# EAGLE design SoundShield (EAGLE 9.6.2)
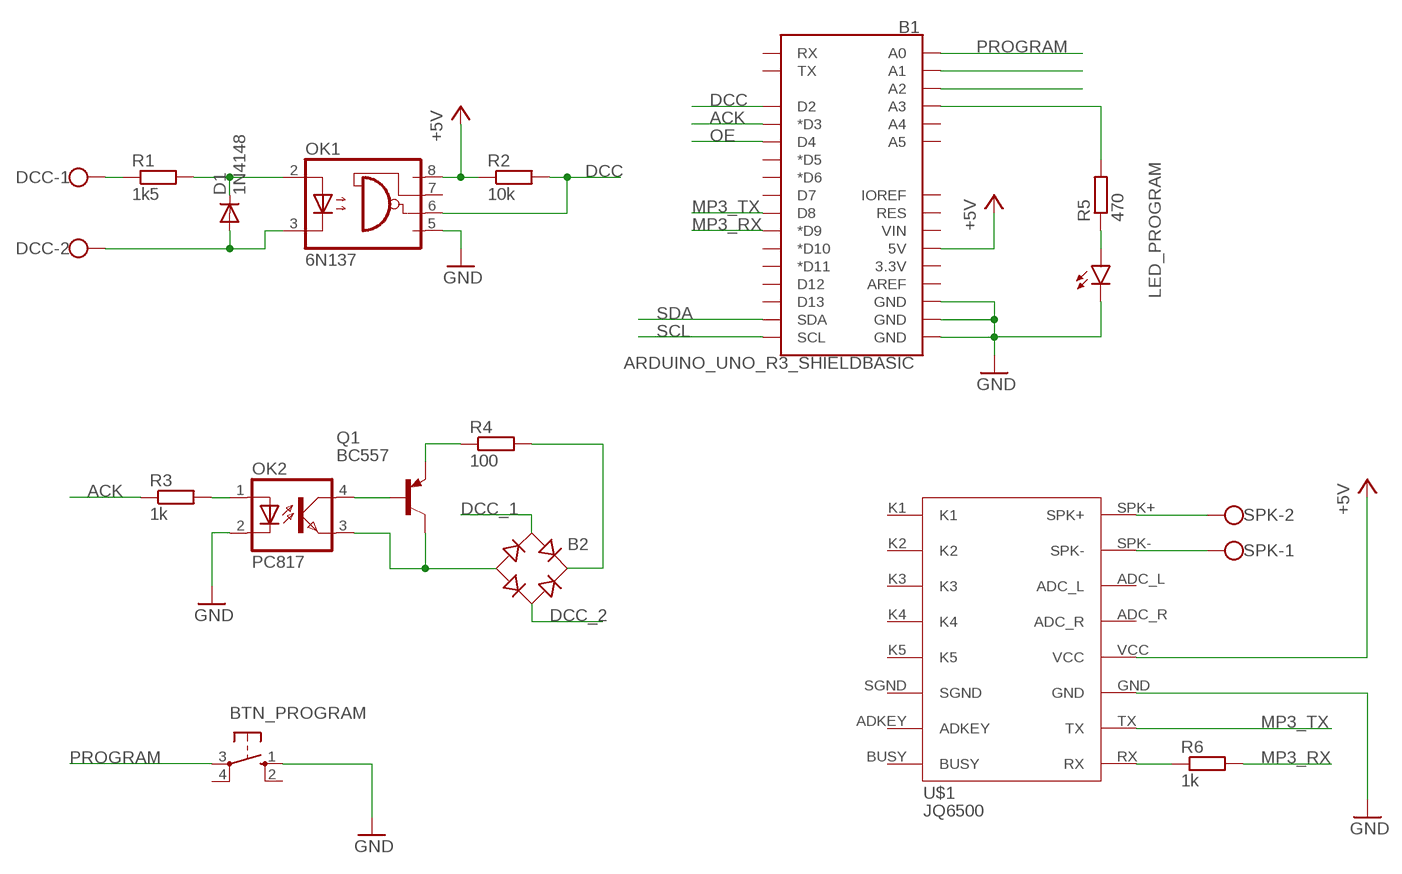
[diagram p0: schematic, sheet 1]

## Parts
B1  ARDUINO_UNO_R3_SHIELDBASIC  [UNO_R3_SHIELD]
B2  RB1A  [RB1A]
BTN_PROGRAM  10-XX  [B3F-10XX]
D1  1N4148  1N4148DO35-7  [DO35-7]
DCC  W237-102  [W237-102]
LED_PROGRAM  LED3MM  [LED3MM]
OK1  6N137  [DIL08]
OK2  PC817  [DIL04]
Q1  BC557  [TO92]
R1  1k5  R-EU_0207/2V  [0207/2V]
R2  10k  R-EU_0207/2V  [0207/2V]
R3  1k  R-EU_0207/2V  [0207/2V]
R4  100  R-EU_0207/2V  [0207/2V]
R5  470  R-EU_0207/2V  [0207/2V]
R6  1k  R-EU_0207/2V  [0207/2V]
SPK  W237-102  [W237-102]
U$1  JQ6500  [JQ6500-PACKAGE]

## Nets
+5V: B1.5V OK1.8(VCC) R2.1 U$1.VCC
ACK: B1.D3(*D3) R3.1
DCC [dcc]: B1.D2 OK1.6(VO) R2.2
DCC_1 [dcc]: B2.AC1 DCC.1 R1.1
DCC_2 [dcc]: B2.AC2 D1.A DCC.2 OK1.3(C)
DOWN: B1.A2
GND: B1.GND@0(GND) B1.GND@1(GND) B1.GND@2(GND) BTN_PROGRAM.1(S) LED_PROGRAM.K(C) OK1.5(GND) OK2.2(C) U$1.GND
MP3_RX: B1.D9(*D9) R6.2
MP3_TX: B1.D8 U$1.TX
N$1: B2.- OK2.3(EMIT) Q1.3(C)
N$2: D1.C OK1.2(A) R1.2
N$3: B1.A3 R5.2
N$4: LED_PROGRAM.A R5.1
N$5: SPK.2 U$1.SPK+
N$6: SPK.1 U$1.SPK-
N$8: OK2.1(A) R3.2
N$9: OK2.4(COL) Q1.2(B)
N$10: Q1.1(E) R4.1
N$11: B2.+ R4.2
N$12: R6.1 U$1.RX
OE: B1.D4
PROGRAM: B1.A0 BTN_PROGRAM.3(P)
SCL: B1.SCL
SDA: B1.SDA
UP: B1.A1
Unconnected: B1.3.3V B1.A4 B1.A5 B1.AREF B1.D5(*D5) B1.D6(*D6) B1.D7 B1.D10(*D10) B1.D11(*D11) B1.D12 B1.D13 B1.IOREF B1.RES B1.RX B1.TX B1.VIN BTN_PROGRAM.2(S1) BTN_PROGRAM.4(P1) OK1.7(VE) U$1.ADC_L U$1.ADC_R U$1.ADKEY U$1.BUSY U$1.K1 U$1.K2 U$1.K3 U$1.K4 U$1.K5 U$1.SGND

## Library data of the parts
B1 = SparkFun-Boards:ARDUINO_UNO_R3_SHIELD: Arduino R3 Shield Footprint Shield form compatible with the Arduino Uno R3. SparkFun Products: MG2639 Cellular Shield <https://www.sparkfun.com/products/13120> MIDI Shield <https://www.sparkfun.com/products/12898> R3 Stackable Headers Kit <https://www.sparkfun.com/products/11417>
B2 = rectifier:RB1A: RECTIFIER 1 A
BTN_PROGRAM = switch-omron:10-XX: OMRON SWITCH; MPN: B3F-1000; OC_FARNELL: 176432; OC_NEWARK: 36M3542
D1 = diode:1N4148: DIODE high speed (Philips)
DCC SPK = con-wago-500:W237-102: WAGO SCREW CLAMP; MPN: 237-102; OC_FARNELL: unknown; OC_NEWARK: 70K9898
LED_PROGRAM = led:LED: LED OSRAM: - CHIPLED LG R971, LG N971, LY N971, LG Q971, LY Q971, LO R971, LY R971 LH N974, LH R974 LS Q976, LO Q976, LY Q976 LO Q996 - Hyper CHIPLED LW Q18S LB Q993, LB Q99A, LB R99A - SideLED LS A670, LO A670, LY A670, LG A670, LP A670 LB A673, LV A673, LT A673, LW A673 LH A674 LY A675 LS A676, LA A676, LO A676, LY A676, LW A676 LS A679, LY A679, LG A679 - Hyper Micro SIDELED® LS Y876, LA Y876, LO Y876, LY Y876 LT Y87S - SmartLED LW L88C, LW L88S LB L89C, LB L89S, LG L890 LS L89K, LO L89K, LY L89K LS L896, LA L896, LO L896, LY L896 - TOPLED LS T670, LO T670, LY T670, LG T670, LP T670 LSG T670, LSP T670, LSY T670, LOP T670, LYG T670 LG T671, LOG T671, LSG T671 LB T673, LV T673, LT T673, LW T673 LH T674 LS T676, LA T676, LO T676, LY T676, LB T676, LH T676, LSB T676, LW T676 LB T67C, LV T67C, LT T67C, LS T67K, LO T67K, LY T67K, LW E67C LS E67B, LA E67B, LO E67B, LY E67B, LB E67C, LV E67C, LT E67C LW T67C LS T679, LY T679, LG T679 LS T770, LO T770, LY T770, LG T770, LP T770 LB T773, LV T773, LT T773, LW T773 LH T774 LS E675, LA E675, LY E675, LS T675 LS T776, LA T776, LO T776, LY T776, LB T776 LHGB T686 LT T68C, LB T68C - Hyper Mini TOPLED® LB M676 - Mini TOPLED Santana® LG M470 LS M47K, LO M47K, LY M47K Source: http://www.osram.convergy.de LUXEON: - LUMILED® LXK2-PW12-R00, LXK2-PW12-S00, LXK2-PW14-U00, LXK2-PW14-V00 LXK2-PM12-R00, LXK2-PM12-S00, LXK2-PM14-U00 LXK2-PE12-Q00, LXK2-PE12-R00, LXK2-PE12-S00, LXK2-PE14-T00, LXK2-PE14-U00 LXK2-PB12-K00, LXK2-PB12-L00, LXK2-PB12-M00, LXK2-PB14-N00, LXK2-PB14-P00, LXK2-PB14-Q00 LXK2-PR12-L00, LXK2-PR12-M00, LXK2-PR14-Q00, LXK2-PR14-R00 LXK2-PD12-Q00, LXK2-PD12-R00, LXK2-PD12-S00 LXK2-PH12-R00, LXK2-PH12-S00 LXK2-PL12-P00, LXK2-PL12-Q00, LXK2-PL12-R00 Source: www.luxeon.com KINGBRIGHT: KA-3528ASYC Source: www.kingbright.com
OK1 = optocoupler:6N137: MOTOROLA OPTO COUPLER; MPN: 6N137; OC_FARNELL: 1328376; OC_NEWARK: 52M1895
OK2 = optocoupler:PC817: SHARP OPTO COUPLER; MPN: PC817X4J000F; OC_FARNELL: 9707727; OC_NEWARK: 97K7059
Q1 = transistor-pnp:BC557: PNP Transistor
R1-R6 = rcl:R-EU_: RESISTOR, European symbol
U$1 = LucaDentella:JQ6500

## Net classes
1 dcc: width 0.406 mm

## Board
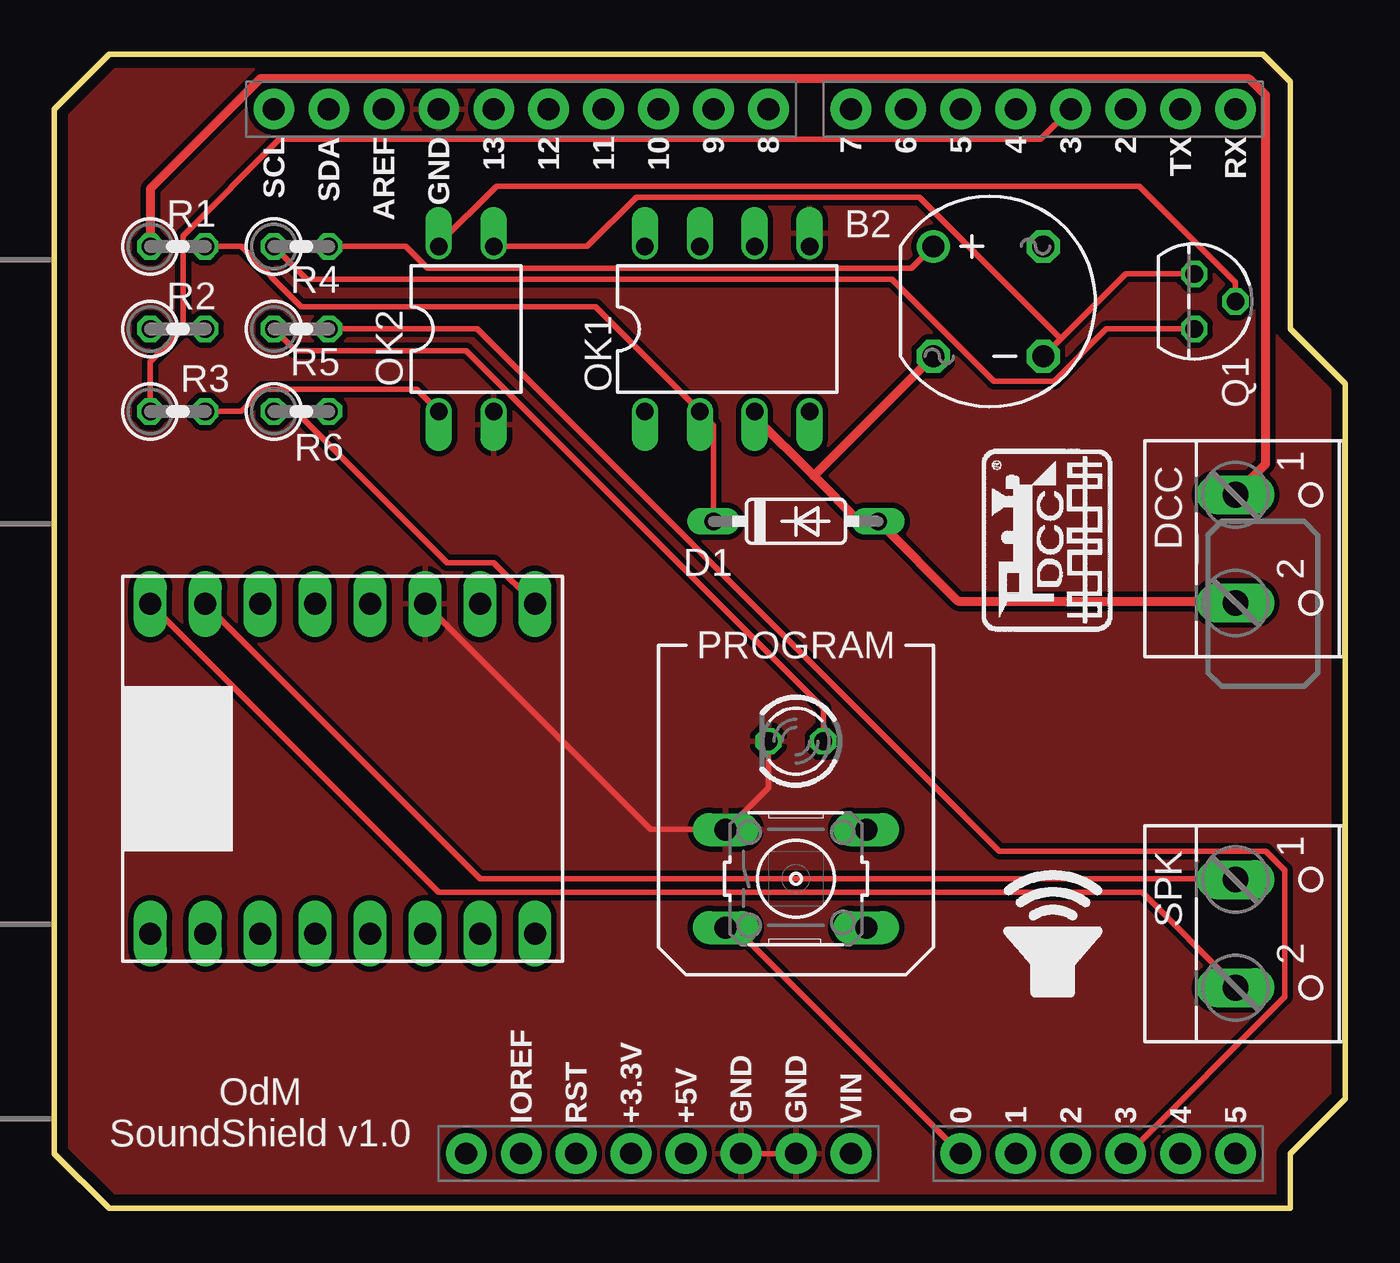
[diagram p1: board, top side]
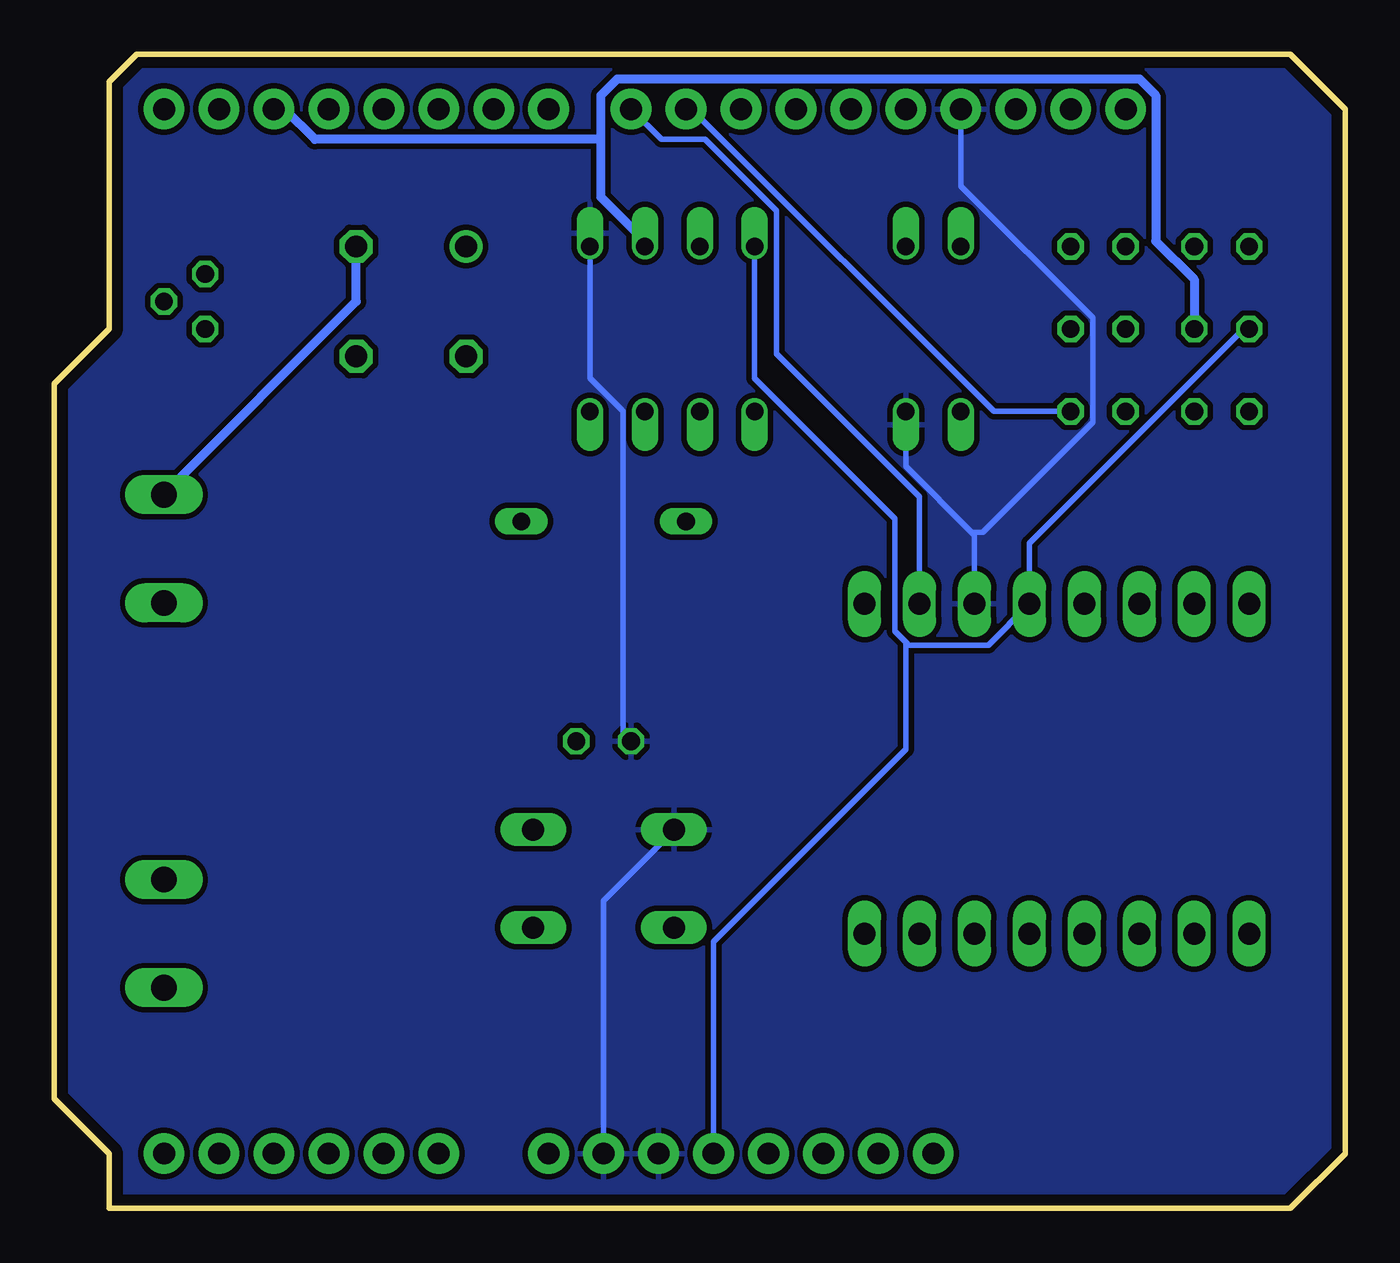
[diagram p2: board, bottom side, seen from below]

Size 59.69 x 53.34 mm. Coordinates in mm from the lower left corner, seen from the top.
Outline: 0,2.54 0,50.8 2.54,53.34 55.88,53.34 57.15,52.07 57.15,40.64 59.69,38.1 59.69,5.08 57.15,2.54 57.15,0 2.54,0 0,2.54
Copper layers (1*16): Top 0.035mm / dielectric 1.6mm / Bottom 0.035mm
Design rules "Elecrow_2-layer_PCB_eagle_rule *": minimum track width 10mil, minimum drill 12mil, track to track 10mil, track to pad 10mil, pad to pad 12mil, via to via 12mil, smd to smd 0mil, copper to edge 20mil, drill to drill 10mil, minimum pad ring 6mil, minimum via ring 6mil, stop-mask expansion 0mil, vias tented up to drill 100mil, thermal gap 10mil

### Footprints (pad centres in the part's own frame; a part is rotated, then mirrored left to right if it is on the bottom)
UNO_R3_SHIELD = drill 1.016 pad 1.88: 3.3V 24.13,-2.54; 5V 24.13,0; A0 24.13,12.7; A1 24.13,15.24; A2 24.13,17.78; A3 24.13,20.32; A4 24.13,22.86; A5 24.13,25.4; AREF -24.13,-13.97; D2 -24.13,20.32; D3 -24.13,17.78; D4 -24.13,15.24; D5 -24.13,12.7; D6 -24.13,10.16; D7 -24.13,7.62; D8 -24.13,3.81; D9 -24.13,1.27; D10 -24.13,-1.27; D11 -24.13,-3.81; D12 -24.13,-6.35; D13 -24.13,-8.89; GND@0 24.13,2.54; GND@1 24.13,5.08; GND@2 -24.13,-11.43; IOREF 24.13,-7.62; NC 24.13,-10.16; RES 24.13,-5.08; RX -24.13,25.4; SCL -24.13,-19.05; SDA -24.13,-16.51; TX -24.13,22.86; VIN 24.13,7.62
RB1A = drill 1.016: + -2.54,2.54 | drill 1.016 octagon: - 2.54,-2.54; AC1 2.54,2.54; AC2 -2.54,-2.54
B3F-10XX = drill 1.016 long: 1 -3.251,2.261; 2 3.251,2.261; 3 -3.251,-2.261; 4 3.251,-2.261
DO35-7 = drill 0.813 long: A 3.81,0; C -3.81,0
W237-102 = drill 1.194 long: 1 -2.5,-1.27; 2 2.5,-1.27
LED3MM = drill 0.813 octagon: A -1.27,0; K 1.27,0
DIL08 = drill 0.813 offset: 1 -3.81,-3.81; 2 -1.27,-3.81; 3 1.27,-3.81; 4 3.81,-3.81; 5 3.81,3.81; 6 1.27,3.81; 7 -1.27,3.81; 8 -3.81,3.81
DIL04 = drill 0.813 offset: 1 -1.27,-3.81; 2 1.27,-3.81; 3 1.27,3.81; 4 -1.27,3.81
TO92 = drill 0.813 octagon: 1 1.27,0; 2 0,1.905; 3 -1.27,0
0207/2V = drill 0.813 octagon: 1 -1.27,0; 2 1.27,0
JQ6500-PACKAGE = drill 1.016 long: ADC_L 7.62,3.81; ADC_R 7.62,1.27; ADKEY -7.62,-6.35; BUSY -7.62,-8.89; GND 7.62,-3.81; K1 -7.62,8.89; K2 -7.62,6.35; K3 -7.62,3.81; K4 -7.62,1.27; K5 -7.62,-1.27; RX 7.62,-8.89; SGND -7.62,-3.81; SPK+ 7.62,8.89; SPK- 7.62,6.35; TX 7.62,-6.35; VCC 7.62,-1.27

### Placement (x,y rotation side)
B1  29.21,26.67 270 top
B2  43.18,41.91 0 top
BTN_PROGRAM  34.29,15.24 0 top
D1  34.29,31.75 0 top
DCC  55.88,30.48 270 top
LED_PROGRAM  34.29,21.59 180 top
OK1  31.11,40.64 0 top
OK2  19.05,40.64 0 top
Q1  52.7,41.91 270 top
R1  5.71,44.45 0 top
R2  5.71,40.64 0 top
R3  5.71,36.83 0 top
R4  11.43,44.45 0 top
R5  11.43,40.64 0 top
R6  11.43,36.83 0 top
SPK  55.88,12.7 270 top
U$1  13.34,20.32 90 top
U$2  [DCC_ICON]  48.9,26.67 90 top
U$3  [SPEAKER_ICON]  43.18,8.89 0 top

### Tracks (layer width: path | path; a pad name or v marks a point on that pad's centre or on a via)
+5V
  Bottom 0.254: R2.1 4.7,40.64 14.61,30.73 U$1.VCC 16.51,26.04 20.19,26.04 20.26,26.1 | OK1.8 27.3,38.35 20.83,31.88 20.83,26.67 20.26,26.1 | B1.5V 29.21,12.32 20.32,21.21 20.32,26.04 20.26,26.1
ACK
  Top 0.254: R3.1 4.45,39.12 5.97,40.64 5.97,44.96 10.41,49.4 45.59,49.4 B1.D3
DCC
  Bottom 0.406: R2.2 6.99,42.93 8.76,44.7 8.76,51.44 9.53,52.2 33.66,52.2 34.42,51.44 34.42,49.4 | 34.42,49.4 34.42,46.74 32.38,44.7 OK1.6 | B1.D2 49.02,50.8 47.62,49.4 34.42,49.4
DCC_1
  Top 0.406: R1.1 4.45,47.12 9.53,52.2 55.24,52.2 56.01,51.44 56.01,34.42 54.61,33.02 DCC.1
  Bottom 0.406: B2.AC1 45.72,41.91 54.61,33.02 DCC.1
DCC_2
  Top 0.406: 35.12,33.85 32.38,36.58 OK1.3 | 35.12,33.85 37.21,31.75 D1.A 41.78,28.07 54.61,28.07 DCC.2 | 35.12,33.85 B2.AC2
GND
  Top 0.254: B1.GND@1 B1.GND@0 | LED_PROGRAM.K 33.02,19.43 31.11,17.53 BTN_PROGRAM.1 30.99,17.53 27.56,17.53 U$1.GND
  Bottom 0.254: OK2.2 20.32,34.29 17.21,31.18 | 17.21,31.18 17.14,31.11 U$1.GND | B1.GND@2 17.78,47.24 11.68,41.15 11.68,36.32 16.76,31.24 17.14,31.24 17.21,31.18 | OK1.5 34.92,38.35 33.4,36.83 33.4,21.97 LED_PROGRAM.K | B1.GND@1 34.29,14.22 31.11,17.4 BTN_PROGRAM.1
  pour Top: -1.91,55.24 61.59,55.24 61.59,-2.54 -1.91,-2.54
  pour Bottom: -1.91,55.24 61.59,55.24 61.59,-2.54 -1.91,-2.54
MP3_RX
  Bottom 0.254: R6.2 16.26,36.83 30.23,50.8 B1.D9
MP3_TX
  Bottom 0.254: U$1.TX 19.68,32.89 26.29,39.5 26.29,46.1 29.59,49.4 31.62,49.4 B1.D8
N$1
  Top 0.254: Q1.3 49.53,43.18 46.55,40.2 | B2.- 46.55,40.2 | OK2.3 24.64,44.45 26.92,46.74 40.01,46.74 46.55,40.2
N$2
  Top 0.254: D1.C 30.48,36.2 OK1.2 25.02,41.66 11.43,41.66 8.64,44.45 R1.2
N$3
  Top 0.254: R5.2 19.56,40.64 43.69,16.51 56.01,16.51 56.9,15.62 56.9,9.78 49.66,2.54 B1.A3
N$4
  Top 0.254: LED_PROGRAM.A 35.56,23.11 19.05,39.62 11.18,39.62 R5.1
N$5
  Top 0.254: U$1.SPK+ 17.78,14.61 50.29,14.61 54.61,10.29 SPK.2
N$6
  Top 0.254: U$1.SPK- 19.68,15.24 54.61,15.24 SPK.1
N$8
  Top 0.254: R3.2 8.64,36.83 9.65,37.85 16.76,37.85 OK2.1
N$9
  Top 0.254: Q1.2 54.61,42.8 50.16,47.24 20.45,47.24 17.78,44.58 OK2.4
N$10
  Top 0.254: Q1.1 48.64,40.64 46.23,38.23 43.43,38.23 38.73,42.93 11.68,42.93 R4.1
N$11
  Top 0.254: R4.2 16.26,44.45 17.27,43.43 39.62,43.43 B2.+
N$12
  Top 0.254: R6.1 11.18,36.83 18.16,29.84 20.32,29.84 U$1.RX
PROGRAM
  Top 0.254: B1.A0 31.5,12.95 31.11,12.95 BTN_PROGRAM.3

### Text on the board
tNames: PROGRAM | OdM / SoundShield v1.0